# EasyEDA schematic SCH_G15_Sensor_Matrix_POC_2022-03-18.JSON
TITLE: G15 HALL Sensor POC Board; REV: 1.01; Date: 2021-10-09; Sheet: 1/1; Drawn By: David Stewart; Company: ECE4600 G15
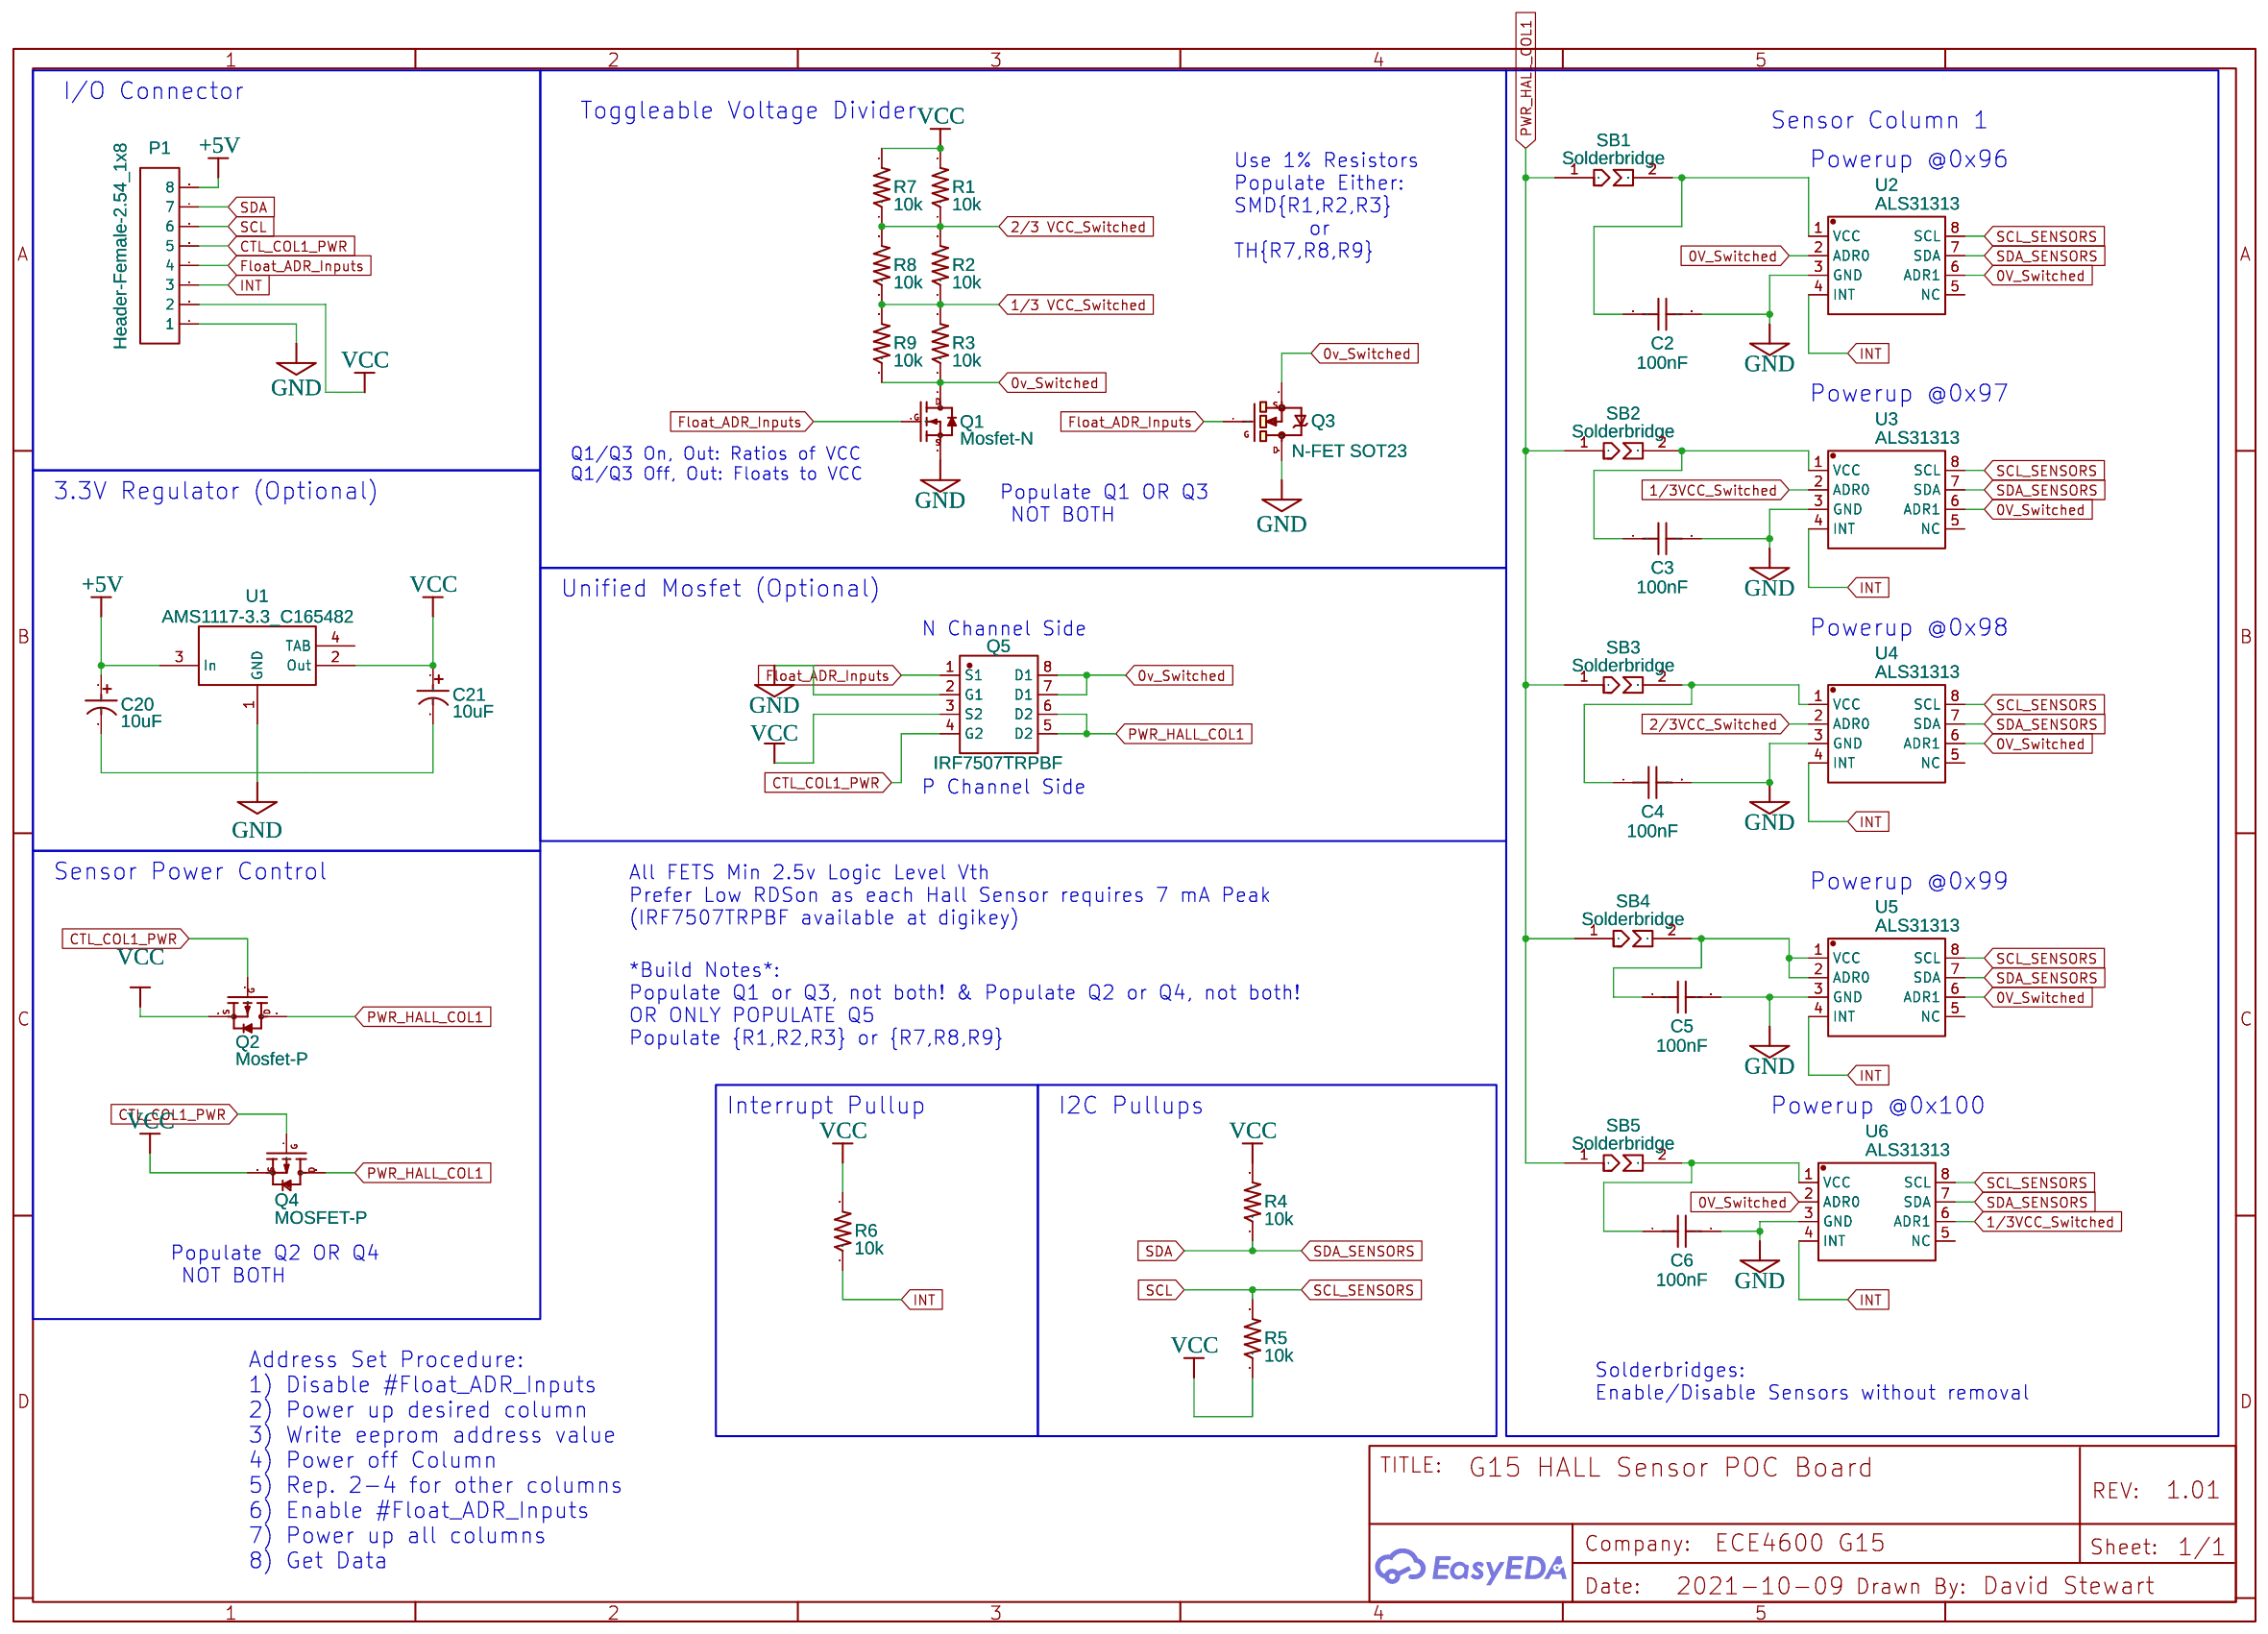
[diagram p0: schematic sheet]

## Parts
C2  100nF  [C0805]
C3  100nF  [C0805]
C4  100nF  [C0805]
C5  100nF  [C0805]
C6  100nF  [C0805]
C20  10uF  [CAP-TH_BD6.3-P2.50-D1.0-FD]
C21  10uF  [CAP-TH_BD6.3-P2.50-D1.0-FD]
P1  Header-Female-2.54_1x8  [HDR-TH_8P-P2.54-V-F-1]
Q1  Mosfet-N  [DC-MOSFET-TO-220]
Q2  Mosfet-P  [DC-MOSFET-TO-220]
Q3  N-FET SOT23  [SOT23-3]
Q4  MOSFET-P  [SEEED-SOT-23]
Q5  IRF7507TRPBF  [MSOP-8_L3.0-W3.0-P0.65-LS5.0-BL]
R1  10k  [R0805]
R2  10k  [R0805]
R3  10k  [R0805]
R4  10k  [R0805]
R5  10k  [R0805]
R6  10k  [R0805]
R7  10k  [AXIAL-6.5X2.3(1/4W)]
R8  10k  [AXIAL-6.5X2.3(1/4W)]
R9  10k  [AXIAL-6.5X2.3(1/4W)]
SB1  Solderbridge  [SOLDERBRIDGE]
SB2  Solderbridge  [SOLDERBRIDGE]
SB3  Solderbridge  [SOLDERBRIDGE]
SB4  Solderbridge  [SOLDERBRIDGE]
SB5  Solderbridge  [SOLDERBRIDGE]
U1  AMS1117-3.3_C165482  [SOT-223_L6.5-W3.5-P2.30-LS7.0-BR]
U2  ALS31313  [TSSOP8-0.65-3X4.4MM]
U3  ALS31313  [TSSOP8-0.65-3X4.4MM]
U4  ALS31313  [TSSOP8-0.65-3X4.4MM]
U5  ALS31313  [TSSOP8-0.65-3X4.4MM]
U6  ALS31313  [TSSOP8-0.65-3X4.4MM]

## Library data of the parts
C2-C6 = C0805C104J5RACAUTO: Supplier: LCSC; Supplier Part: C696366; Manufacturer: KEMET; Contributor: LCSC; JLCPCB Part Class: Extended Part
C20 C21 = 10uf/100V: Supplier: LCSC; Manufacturer: ValuePro; Supplier Part: C2029; JLCPCB Part Class: Extended Part
P1 = Header-Female-2.54_1x8: Supplier: LCSC; Manufacturer: BOOMELE; Manufacturer Part: Female headerHDR1X8-2.54; Supplier Part: C27438; JLCPCB Part Class: Extended Part
Q1 = Mosfet-N: Contributor: dina
Q2 = Mosfet-P: Contributor: dina
Q3 = MOSFET-NCHANNELSMD: Contributor: Pinoccio
Q4 = MOSFET-P
Q5 = IRF7507TRPBF: Supplier: LCSC; Manufacturer: Infineon; Contributor: LCSC; Supplier Part: C150934; JLCPCB Part Class: Extended Part
R1-R9 = R-US_R0805: RESISTOR, American symbol; Contributor: Adafruit
SB1-SB5 = Solderbridge: link: https://www.reichelt.de/philips-i-c-bus-microcontroller-peripherie-smd-pcf-8574-t-p39885.html?&trstct=pol_0; Contributor: Bagger
U1 = AMS1117-3.3_C165482: Supplier: LCSC; Supplier Part: C165482; Manufacturer: SK; Manufacturer Part: AMS1117-3.3; Contributor: LCSC; JLCPCB Part Class: Extended Part
U2-U6 = ALS31313: Supplier: LCSC; Manufacturer: Shanghai Belling; Contributor: aurelien1609

## Nets
0v_Switched: Q1.2(D) Q3.2(S) Q5.7(D1) Q5.8(D1) R3.1 R9.1
0V_Switched: U2.2(ADR0) U2.6(ADR1) U3.6(ADR1) U4.6(ADR1) U5.6(ADR1) U6.2(ADR0)
1/3VCC_Switched: U3.2(ADR0) U6.6(ADR1)
2/3VCC_Switched: U4.2(ADR0)
+5V: C20.1 P1.8 U1.3(In)
GND: C2.2 C3.2 C4.2 C5.2 C6.2 P1.1 Q1.3(S) Q3.3(D) Q5.2(G1) U1.1(GND) U2.3(GND) U3.3(GND) U4.3(GND) U5.3(GND) U6.3(GND)
VCC: C21.1 P1.2 Q2.3(S) Q4.2(S) Q5.3(S2) R1.2 R4.2 R5.1 R6.2 R7.2 U1.2(Out)
1/3 VCC_Switched: R2.1 R3.2 R8.1 R9.2
2/3 VCC_Switched: R1.1 R2.2 R7.1 R8.2
CTL_COL1_PWR: P1.5 Q2.1(G) Q4.1(G) Q5.4(G2)
Float_ADR_Inputs: P1.4 Q1.1(G) Q3.1(G) Q5.1(S1)
INT: P1.3 R6.1 U2.4(INT) U3.4(INT) U4.4(INT) U5.4(INT) U6.4(INT)
PWR_HALL_COL1: Q2.2(D) Q4.3(D) Q5.5(D2) Q5.6(D2) SB1.1 SB2.1 SB3.1 SB4.1 SB5.1
SCL: P1.6 R5.2 U2.8(SCL) U3.8(SCL) U4.8(SCL) U5.8(SCL) U6.8(SCL)
SDA: P1.7 R4.1 U2.7(SDA) U3.7(SDA) U4.7(SDA) U5.7(SDA) U6.7(SDA)
Net-(C2-1): C2.1 SB1.2 U2.1(VCC)
Net-(C3-1): C3.1 SB2.2 U3.1(VCC)
Net-(C4-1): C4.1 SB3.2 U4.1(VCC)
Net-(C5-1): C5.1 SB4.2 U5.1(VCC) U5.2(ADR0)
Net-(C6-1): C6.1 SB5.2 U6.1(VCC)
Net-(C20-2): C20.2 C21.2

Not connected (* = marked no-connect by the designer): U1 4(TAB); U2 5(NC); U3 5(NC); U4 5(NC); U5 5(NC); U6 5(NC)

## Notes on the sheet
- I/O Connector
- Toggleable Voltage Divider
- Sensor Column 1
- Use 1% Resistors
  Populate Either:
  SMD{R1,R2,R3}
         or
  TH{R7,R8,R9}
- Powerup @0x96
- Powerup @0x97
- Q1/Q3 On, Out: Ratios of VCC
  Q1/Q3 Off, Out: Floats to VCC
- 3.3V Regulator (Optional)
- Populate Q1 OR Q3
   NOT BOTH
- Unified Mosfet (Optional)
- N Channel Side
  P Channel Side
- Powerup @0x98
- Sensor Power Control
- All FETS Min 2.5v Logic Level Vth
  Prefer Low RDSon as each Hall Sensor requires 7 mA Peak
  (IRF7507TRPBF available at digikey)
- Powerup @0x99
- *Build Notes*:
  Populate Q1 or Q3, not both! & Populate Q2 or Q4, not both!
  OR ONLY POPULATE Q5
  Populate {R1,R2,R3} or {R7,R8,R9}
- Interrupt Pullup
- I2C Pullups
- Powerup @0x100
- Populate Q2 OR Q4
   NOT BOTH
- Address Set Procedure:
  1) Disable #Float_ADR_Inputs
  2) Power up desired column
  3) Write eeprom address value
  4) Power off Column
  5) Rep. 2-4 for other columns
  6) Enable #Float_ADR_Inputs
  7) Power up all columns
  8) Get Data
- Solderbridges:
  Enable/Disable Sensors without removal
